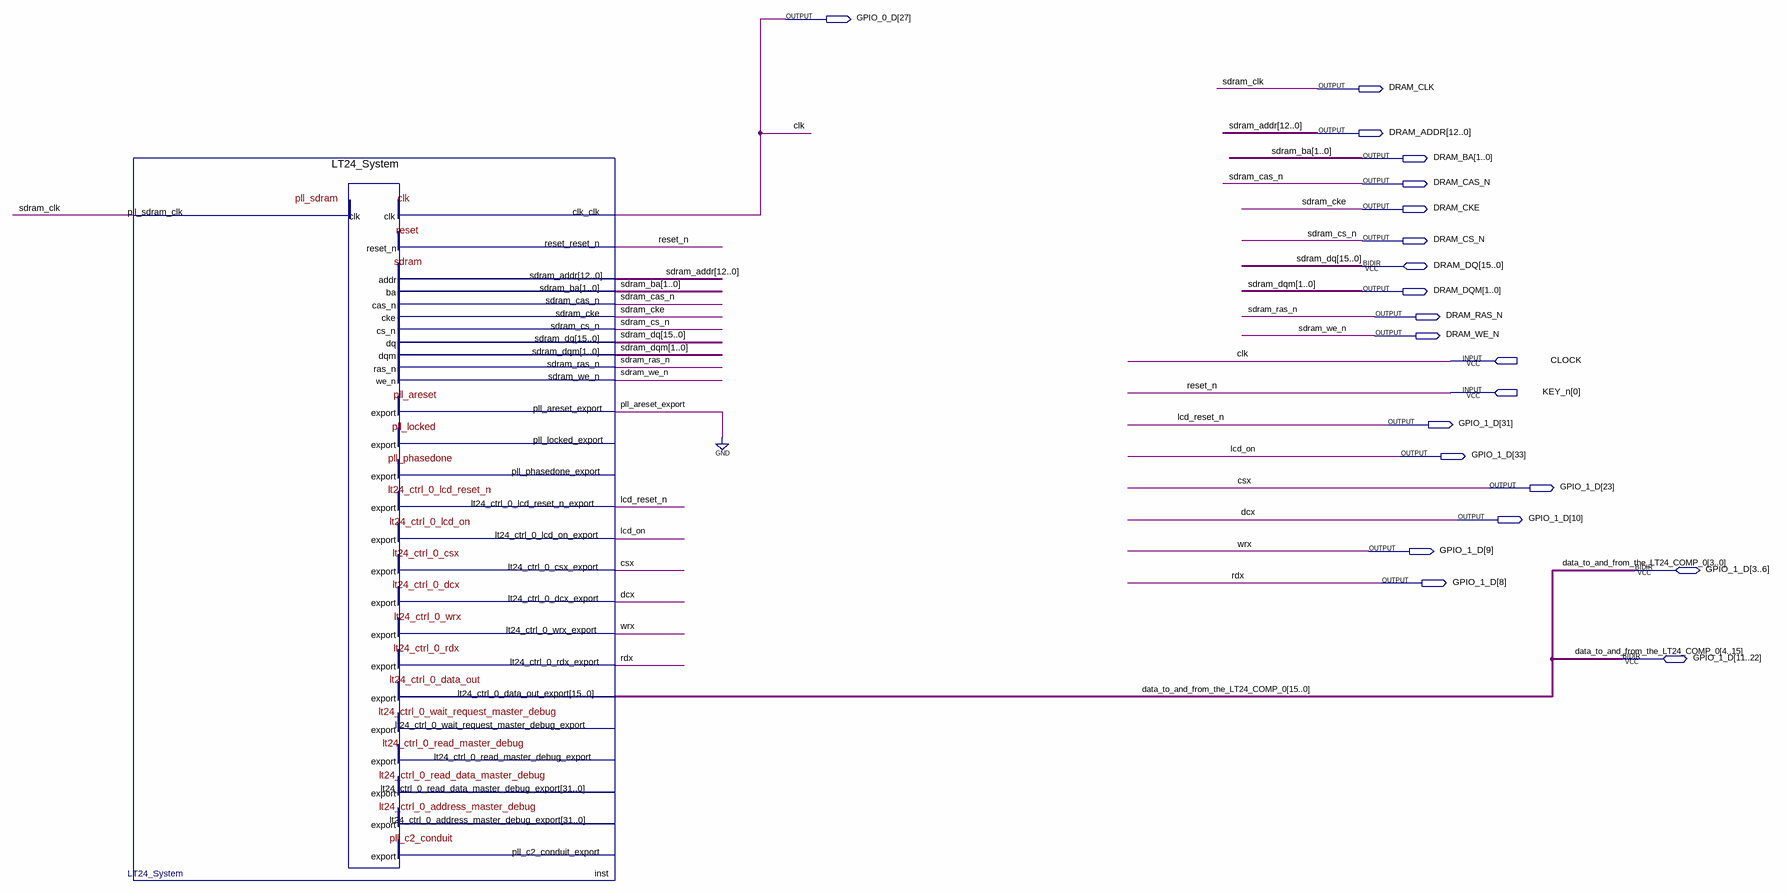
[diagram p0: schematic sheet]
// Quartus schematic LT24_Controller.bdf as structural Verilog: 1 symbols, 21 pins
module LT24_Controller (
  input  CLOCK,
  input  [0:0] KEY_n,
  inout  [15:0] DRAM_DQ,
  inout  [3:33] GPIO_1_D,
  output [27:27] GPIO_0_D,
  output DRAM_CLK,
  output [12:0] DRAM_ADDR,
  output [1:0] DRAM_BA,
  output DRAM_CAS_N,
  output DRAM_CKE,
  output DRAM_CS_N,
  output [1:0] DRAM_DQM,
  output DRAM_RAS_N,
  output DRAM_WE_N
);

  LT24_System inst (
    .clk_clk(CLOCK), .reset_reset_n(KEY_n[0]), .pll_areset_export(1'b0), .sdram_addr(DRAM_ADDR),
    .sdram_ba(DRAM_BA), .sdram_cas_n(DRAM_CAS_N), .sdram_cke(DRAM_CKE), .sdram_cs_n(DRAM_CS_N),
    .sdram_dqm(DRAM_DQM), .sdram_ras_n(DRAM_RAS_N), .sdram_we_n(DRAM_WE_N), .pll_sdram_clk(DRAM_CLK),
    .lt24_ctrl_0_lcd_reset_n_export(GPIO_1_D[31]), .lt24_ctrl_0_lcd_on_export(GPIO_1_D[33]),
    .lt24_ctrl_0_csx_export(GPIO_1_D[23]), .lt24_ctrl_0_dcx_export(GPIO_1_D[10]),
    .lt24_ctrl_0_wrx_export(GPIO_1_D[9]), .lt24_ctrl_0_rdx_export(GPIO_1_D[8]),
    .lt24_ctrl_0_data_out_export({GPIO_1_D[22], GPIO_1_D[21], GPIO_1_D[20], GPIO_1_D[19], GPIO_1_D[18], GPIO_1_D[17], GPIO_1_D[16], GPIO_1_D[15], GPIO_1_D[14], GPIO_1_D[13], GPIO_1_D[12], GPIO_1_D[11], GPIO_1_D[3:6]}),
    .sdram_dq(DRAM_DQ));  // open: pll_locked_export, pll_phasedone_export, lt24_ctrl_0_wait_request_master_debug_export, lt24_ctrl_0_read_master_debug_export, lt24_ctrl_0_read_data_master_debug_export, lt24_ctrl_0_address_master_debug_export, pll_c2_conduit_export

  assign GPIO_0_D[27] = CLOCK;

  // Other names for the same wires on the sheet: clk = CLOCK; csx = GPIO_1_D[23];
  //   data_to_and_from_the_LT24_COMP_0[15:0] = {GPIO_1_D[22], GPIO_1_D[21], GPIO_1_D[20], GPIO_1_D[19], GPIO_1_D[18], GPIO_1_D[17], GPIO_1_D[16], GPIO_1_D[15], GPIO_1_D[14], GPIO_1_D[13], GPIO_1_D[12], GPIO_1_D[11], GPIO_1_D[3:6]};
  //   dcx = GPIO_1_D[10]; lcd_on = GPIO_1_D[33]; lcd_reset_n = GPIO_1_D[31]; rdx = GPIO_1_D[8]; reset_n = KEY_n[0];
  //   sdram_addr[12:0] = DRAM_ADDR; sdram_ba[1:0] = DRAM_BA; sdram_cas_n = DRAM_CAS_N; sdram_cke = DRAM_CKE;
  //   sdram_clk = DRAM_CLK; sdram_cs_n = DRAM_CS_N; sdram_dq[15:0] = DRAM_DQ; sdram_dqm[1:0] = DRAM_DQM;
  //   sdram_ras_n = DRAM_RAS_N; sdram_we_n = DRAM_WE_N; wrx = GPIO_1_D[9]
endmodule
